# Altium project EE_smallOB_BW_v1.0.PrjPcb (part 4 of 4)

## Sheet interface2.SchDoc
size A
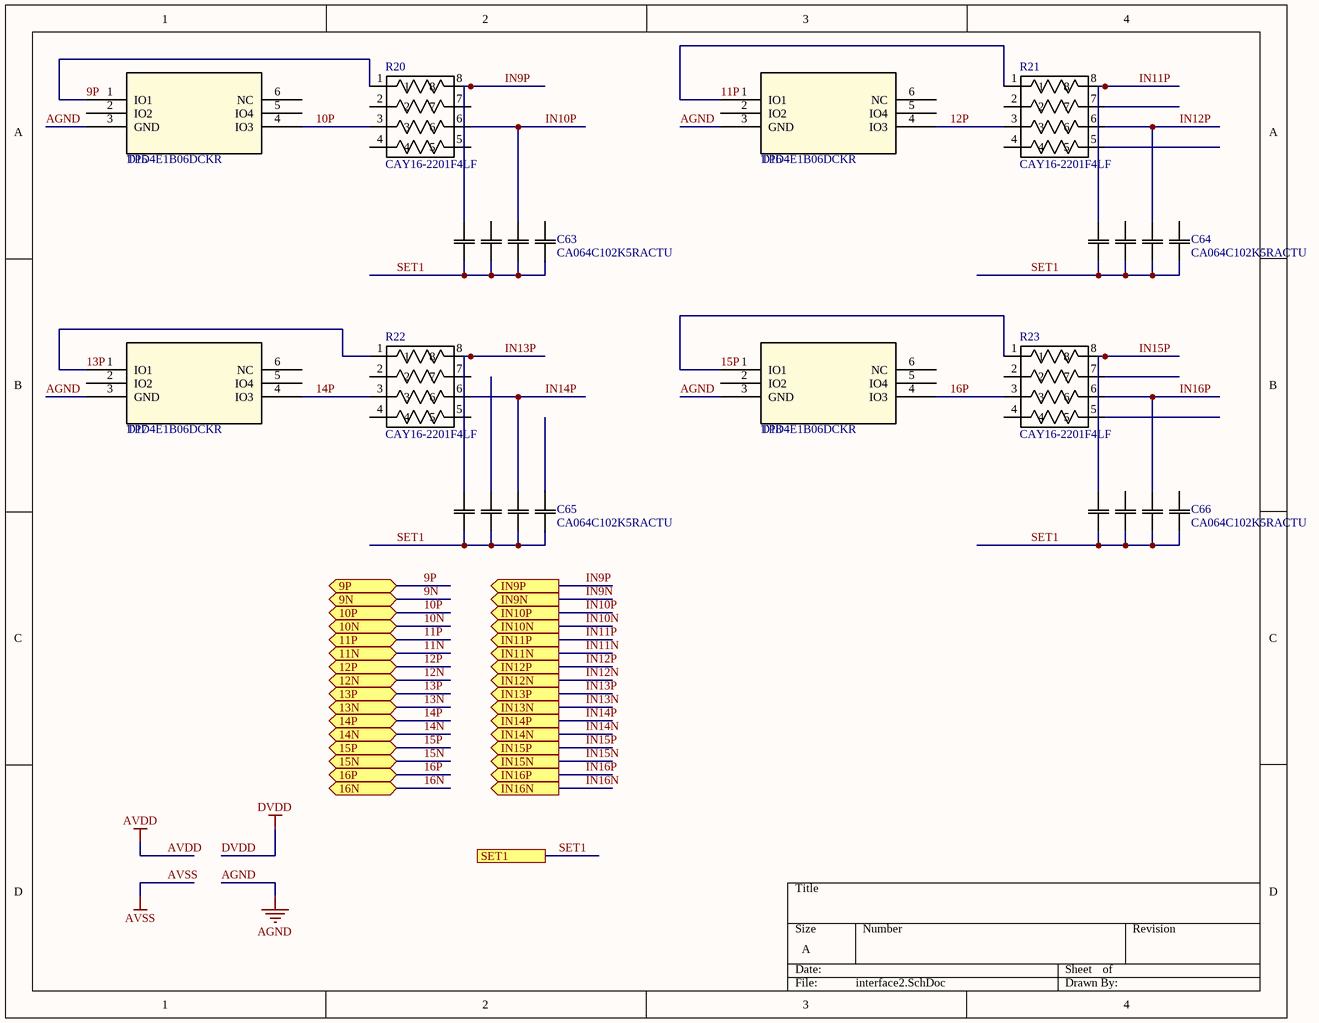
[diagram p5: interface2.SchDoc]

### Parts
C63  CA064C102K5RACTU  [CA064]
C64  CA064C102K5RACTU  [CA064]
C65  CA064C102K5RACTU  [CA064]
C66  CA064C102K5RACTU  [CA064]
D15  TPD4E1B06DCKR  [DCK6]
D16  TPD4E1B06DCKR  [DCK6]
D17  TPD4E1B06DCKR  [DCK6]
D18  TPD4E1B06DCKR  [DCK6]
R20  CAY16-2201F4LF  [*RESCAXE80P320X160-8N]
R21  CAY16-2201F4LF  [*RESCAXE80P320X160-8N]
R22  CAY16-2201F4LF  [*RESCAXE80P320X160-8N]
R23  CAY16-2201F4LF  [*RESCAXE80P320X160-8N]

### Ports
9N (bidir), 9P (bidir), 10N (bidir), 10P (bidir), 11N (bidir), 11P (bidir), 12N (bidir), 12P (bidir), 13N (bidir), 13P (bidir), 14N (bidir), 14P (bidir), 15N (bidir), 15P (bidir), 16N (bidir), 16P (bidir), IN9N (out), IN9P (out), IN10N (out), IN10P (out), IN11N (out), IN11P (out), IN12N (out), IN12P (out), IN13N (out), IN13P (out), IN14N (out), IN14P (out), IN15N (out), IN15P (out), IN16N (out), IN16P (out), SET1

### Nets
AGND: D15.3(GND) D16.3(GND) D17.3(GND) D18.3(GND)
9N: port 9N
9P: D15.1(IO1) R20.1 ; port 9P
10N: port 10N
10P: D15.4(IO3) R20.3 ; port 10P
11N: port 11N
11P: D16.1(IO1) R21.1 ; port 11P
12N: port 12N
12P: D16.4(IO3) R21.3 ; port 12P
13N: port 13N
13P: D17.1(IO1) R22.1 ; port 13P
14N: port 14N
14P: D17.4(IO3) R22.3 ; port 14P
15N: port 15N
15P: D18.1(IO1) R23.1 ; port 15P
16N: port 16N
16P: D18.4(IO3) R23.3 ; port 16P
IN9N: port IN9N
IN9P: C63.8 R20.8 ; port IN9P
IN10N: port IN10N
IN10P: C63.6 R20.6 ; port IN10P
IN11N: port IN11N
IN11P: C64.8 R21.8 ; port IN11P
IN12N: port IN12N
IN12P: C64.6 R21.6 ; port IN12P
IN13N: port IN13N
IN13P: C65.8 R22.8 ; port IN13P
IN14N: port IN14N
IN14P: C65.6 R22.6 ; port IN14P
IN15N: port IN15N
IN15P: C66.8 R23.8 ; port IN15P
IN16N: port IN16N
IN16P: C66.6 R23.6 ; port IN16P
SET1: C63.1 C63.2 C63.3 C63.4 C64.1 C64.2 C64.3 C64.4 C65.1 C65.2 C65.3 C65.4 C66.1 C66.2 C66.3 C66.4 ; port SET1

Not connected (* = marked no-connect by the designer): C63 5 7; C64 5 7; C65 5 7; C66 5 7; D15 2(IO2) 5(IO4) 6(NC); D16 2(IO2) 5(IO4) 6(NC); D17 2(IO2) 5(IO4) 6(NC); D18 2(IO2) 5(IO4) 6(NC); R20 2 4 5 7; R21 2 4 5 7; R22 2 4 5 7; R23 2 4 5 7

### Library data of the parts
C63-C66 = CA064C102K5RACTU: CAP ARRAY 1000PF 50V X7R 0612; Manufacturer 1: KEMET; Dielectric Material: Ceramic; Capacitance: 1nF; Tolerance: 10%; Number of Capacitors: 4; Circuit Type: Isolated; Supplier 1: Digi-Key; Manufacturer Part Number 1: CA064C102K5RACTU; Stock 1: 12; Pricing 1: 1=0.61000, 10=0.42800, 100=0.28180, 500=0.20874, 1000=0.17743 (USD); RoHS: Yes; Mount: Surface Mount; Case/Package: 0612; Case Code (Metric): 1632; Case Code (Imperial): 0612; Contact Plating: Tin,Matte; Number of Terminals: 8; Min Operating Temperature: -55°C; Max Operating Temperature: 125°C; Packaging: Tape and Reel; Package Quantity: 4000; Voltage Rating: 50V; Dielectric: X7R; Termination: SMD/SMT; Number of Elements: 4; Voltage Rating (DC): 50V; Number of Circuits: 4; Length: 0.063inch; Height: 0.8mm; Width: 1.6mm; Height - Seated (Max): 0.035inch; Terminal Pitch: 0.8mm; REACH SVHC: No SVHC; Lead Free: Lead Free; ComponentLink1URL: http://www.farnell.com/datasheets/1868478.pdf?src-supplier=Farnell; ComponentLink1Description: http://www.farnell.com/datasheets/1868478.pdf?src-supplier=Farnell; ComponentLink2URL: https://media.digikey.com/pdf/Data%20Sheets/Kemet%20PDFs/X7R_Dielectric_10-200V_Rev_Nov2013.pdf?src-supplier=Digi-Key; ComponentLink2Description: https://media.digikey.com/pdf/Data%20Sheets/Kemet%20PDFs/X7R_Dielectric_10-200V_Rev_Nov2013.pdf?src-supplier=Digi-Key; ComponentLink3URL: http://www.mouser.com/ds/2/212/KEM_C1017_X7R_ARRAY_SMD-1102778.pdf?src-supplier=Mouser; ComponentLink3Description: http://www.mouser.com/ds/2/212/KEM_C1017_X7R_ARRAY_SMD-1102778.pdf?src-supplier=Mouser; ComponentLink4URL: http://www.farnell.com/datasheets/1868478.pdf?src-supplier=Element14; ComponentLink4Description: http://www.farnell.com/datasheets/1868478.pdf?src-supplier=Element14; ComponentLink5URL: http://capacitoredge.kemet.com/capedge2/DataSheet/Datasheet-CA064C102K5RACTU.pdf?pn=CA064C102K5RACTU&src-supplier=Avnet; ComponentLink5Description: http://capacitoredge.kemet.com/capedge2/DataSheet/Datasheet-CA064C102K5RACTU.pdf?pn=CA064C102K5RACTU&src-supplier=Avnet; ComponentLink6URL: http://capacitoredge.kemet.com/capedge2/DataSheet/Datasheet-CA064C102K5RACTU.pdf?pn=CA064C102K5RACTU&src-supplier=Avnet+Asia; ComponentLink6Description: http://capacitoredge.kemet.com/capedge2/DataSheet/Datasheet-CA064C102K5RACTU.pdf?pn=CA064C102K5RACTU&src-supplier=Avnet+Asia; Supplier Part Number 1: 399-9415-1-ND
D15-D18 = TPD4E1B06DCKR: TVS DIODE 5.5VWM 14.5VC SC70-6; Manufacturer 1: Texas Instruments; Capacitance: 1pF; Operating Supply Voltage: 5.5V; Direction: Bidirectional,Unidirectional; Number of Bidirectional Channels: 4; Min Breakdown Voltage: 7V; Clamping Voltage: 14.5V; Peak Pulse Power: 45W; Power Line Protection: No; Polarity: Bidirectional; ESD Protection: Yes; Max Reverse Leakage Current: 500pA; Test Current: 1mA; Peak Pulse Current: 3A; Interface: LVDS,USB; Supplier 1: Digi-Key; Manufacturer Part Number 1: TPD4E1B06DCKR; Stock 1: 27694; Pricing 1: 1=0.58000, 10=0.49400, 100=0.36920, 500=0.29004, 1000=0.22413 (USD); RoHS: Yes; Mount: Surface Mount; Case/Package: SC; Number of Pins: 6; Min Operating Temperature: -40°C; Max Operating Temperature: 125°C; Package Quantity: 3000; Packaging: Tape and Reel; Reverse Standoff Voltage: 5.5V; Breakdown Voltage: 7V; Number of Channels: 4; Termination: SMD/SMT; Working Voltage: 5.5V; Max Power Dissipation: 45W; Length: 2.15mm; Height: 1mm; Width: 1.4mm; REACH SVHC: No SVHC; Lead Free: Lead Free; ComponentLink1URL: https://datasheet.ciiva.com/12545/tpd4e1b06-224687-12545147.pdf?src-supplier=Mouser; ComponentLink1Description: https://datasheet.ciiva.com/12545/tpd4e1b06-224687-12545147.pdf?src-supplier=Mouser; ComponentLink2URL: https://datasheet.ciiva.com/6574/tpd4e1b06-6574671.pdf?src-supplier=Digi-Key; ComponentLink2Description: https://datasheet.ciiva.com/6574/tpd4e1b06-6574671.pdf?src-supplier=Digi-Key; Supplier Part Number 1: 296-39346-1-ND
R20-R23 = CAY16-2201F4LF: BOURNS         CAY16-2201F4LF             RESISTOR, ARRAY-4, 2.2KOHM, 5%, SMD; Resistance: 2.2kR; Tolerance: 1%; Power Rating: 248mW; Voltage Rating: 50V; Number of Elements: 4; Circuit Type: Isolated; Power Per Element: 62.5mW; Temperature Coefficient: 200ppm/°C; Supplier 1: Digi-Key; Manufacturer 1: Bourns; Manufacturer Part Number 1: CAY16-2201F4LF; Stock 1: 35310; Pricing 1: 1=0.14000, 10=0.12100, 25=0.08800, 50=0.06380, 100=0.04730, 250=0.03632, 500=0.02860, 1000=0.01980 (USD); RoHS: Yes; Mount: Surface Mount; Case/Package: 1206; Number of Pins: 8; Case Code (Metric): 3216; Case Code (Imperial): 1206; Number of Terminals: 8; Contact Plating: Tin; Min Operating Temperature: -55°C; Max Operating Temperature: 125°C; Packaging: Tape and Reel; Package Quantity: 1; Number of Resistors: 4; Termination: Convex; Military Standard: Not; Voltage Rating (DC): 50V; Number of Circuits: 4; Length: 3.2mm; Height: 0.024inch; Width: 0.063inch; Lead Pitch: 0.8mm; Terminal Pitch: 0.8mm; Depth: 1.6mm; REACH SVHC: No SVHC; Lead Free: Lead Free; ComponentLink1URL: https://datasheet.ciiva.com/11807/0900766b8064e462-11807027.pdf?src-supplier=RSComponents; ComponentLink1Description: https://datasheet.ciiva.com/11807/0900766b8064e462-11807027.pdf?src-supplier=RSComponents; ComponentLink2URL: https://datasheet.ciiva.com/16967/catcay-16967355.pdf?src-supplier=Avnet+Europe; ComponentLink2Description: https://datasheet.ciiva.com/16967/catcay-16967355.pdf?src-supplier=Avnet+Europe; ComponentLink3URL: https://datasheet.ciiva.com/6533/catcay-6533677.pdf?src-supplier=Digi-Key; ComponentLink3Description: https://datasheet.ciiva.com/6533/catcay-6533677.pdf?src-supplier=Digi-Key; ComponentLink4URL: https://datasheet.ciiva.com/30021/catcay-30021357.pdf?src-supplier=Avnet; ComponentLink4Description: https://datasheet.ciiva.com/30021/catcay-30021357.pdf?src-supplier=Avnet; ComponentLink5URL: https://datasheet.ciiva.com/1478/1849489-1478846.pdf?src-supplier=Element14; ComponentLink5Description: https://datasheet.ciiva.com/1478/1849489-1478846.pdf?src-supplier=Element14; ComponentLink6URL: https://datasheet.ciiva.com/6533/catcay-6533678.pdf?src-supplier=Digi-Key; ComponentLink6Description: https://datasheet.ciiva.com/6533/catcay-6533678.pdf?src-supplier=Digi-Key; ComponentLink7URL: https://datasheet.ciiva.com/1478/1849489-1478847.pdf?src-supplier=Element14; ComponentLink7Description: https://datasheet.ciiva.com/1478/1849489-1478847.pdf?src-supplier=Element14; ComponentLink8URL: https://datasheet.ciiva.com/6533/catcay-6533679.pdf?src-supplier=Digi-Key; ComponentLink8Description: https://datasheet.ciiva.com/6533/catcay-6533679.pdf?src-supplier=Digi-Key; ComponentLink9URL: https://datasheet.ciiva.com/48692/001055385-da-01-en-wid-arr-cay16-2201f4lf-2-2k-ohm-4-w-1206-48692149.pdf?src-supplier=Conrad; ComponentLink9Description: https://datasheet.ciiva.com/48692/001055385-da-01-en-wid-arr-cay16-2201f4lf-2-2k-ohm-4-w-1206-48692149.pdf?src-supplier=Conrad; Supplier Part Number 1: CAY16-2201F4LFCT-ND

## Sheet ADS_1.SchDoc
size A
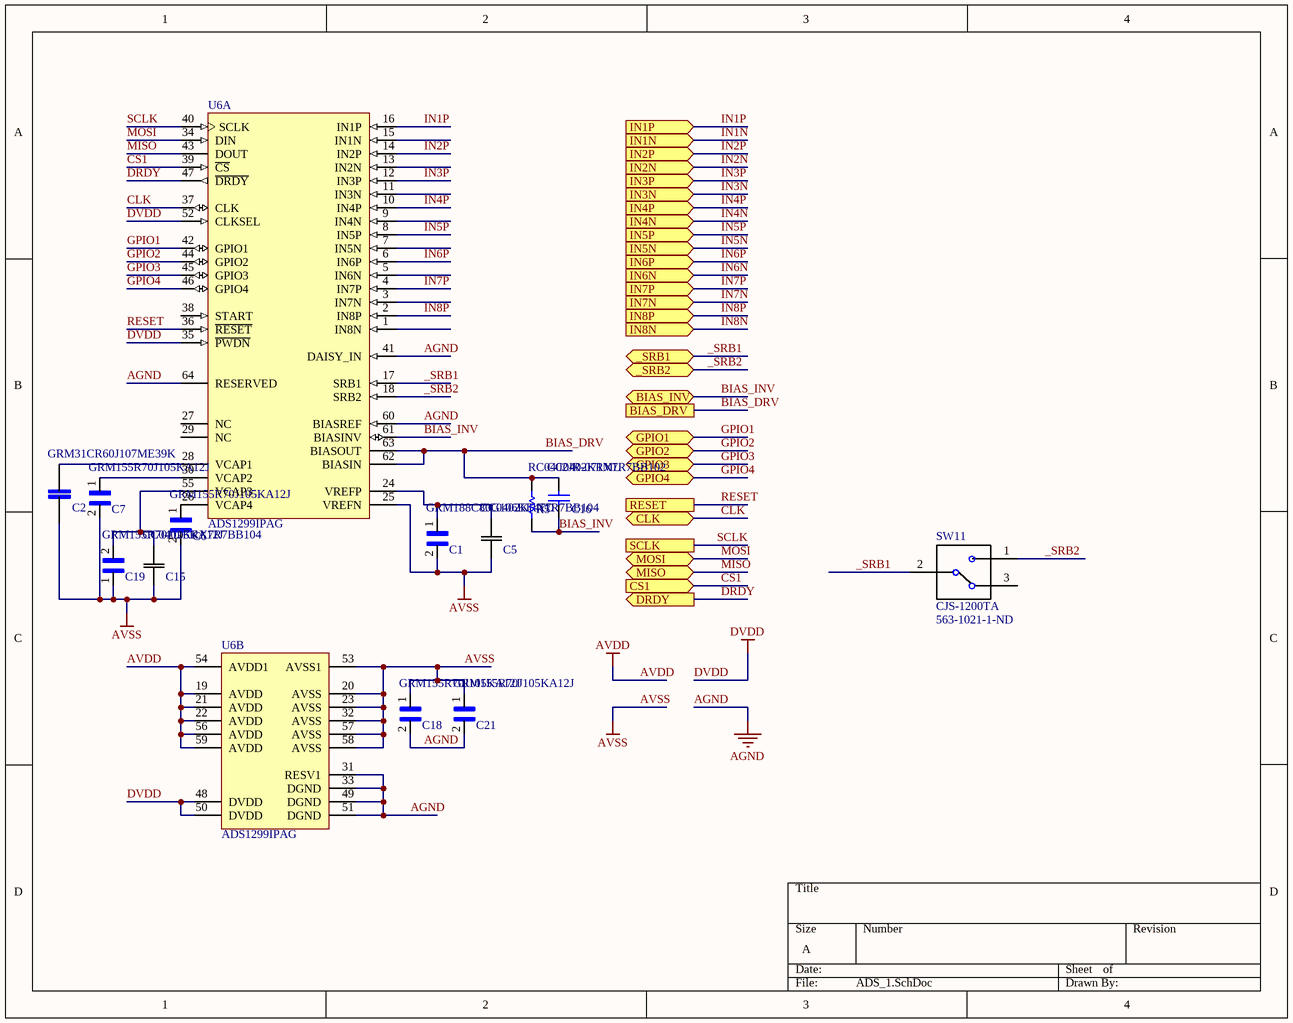
[diagram p6: ADS_1.SchDoc]

### Parts
C1  GRM188C80G106KE47D  [*CAPC1608X90N]
C2  GRM31CR60J107ME39K  [*CAPC3216X190]
C5  CC0402KRX7R7BB104  [YAG_CC0402]
C6  GRM155R70J105KA12J  [*CAPC1005X55N]
C7  GRM155R70J105KA12J  [*CAPC1005X55N]
C15  CC0402KRX7R7BB104  [YAG_CC0402]
C16  CC0402KRX7R7BB102  [CAPC1005X55X23NL05T08]
C18  GRM155R70J105KA12J  [*CAPC1005X55N]
C19  GRM155R70J105KA12J  [*CAPC1005X55N]
C21  GRM155R70J105KA12J  [*CAPC1005X55N]
R5  RC0402JR-071ML  [RESC1005X40X25NL05T10]
SW11  CJS-1200TA  Supplier Part Number 1: 563-1021-1-ND  [*SW_CJS-1200TA]
U6  ADS1299IPAG  [PAG0064A_N]  (parts A,B of 2)

### Ports
_SRB1 (bidir), _SRB2 (bidir), BIAS_DRV, BIAS_INV (bidir), CLK (bidir), CS1 (in), DRDY (out), GPIO1 (bidir), GPIO2 (bidir), GPIO3 (bidir), GPIO4 (bidir), IN1N (in), IN1P (in), IN2N (in), IN2P (in), IN3N (in), IN3P (in), IN4N (in), IN4P (in), IN5N (in), IN5P (in), IN6N (in), IN6P (in), IN7N (in), IN7P (in), IN8N (in), IN8P (in), MISO (bidir), MOSI (bidir), RESET, SCLK

### Nets
AGND: C18.2 C21.2 U6.31(RESV1) U6.33(DGND) U6.41(DAISY_IN) U6.49(DGND) U6.51(DGND) U6.60(BIASREF) U6.64(RESERVED)
AVDD: U6.19(AVDD) U6.21(AVDD) U6.22(AVDD) U6.54(AVDD1) U6.56(AVDD) U6.59(AVDD)
AVSS: C1.2 C2.2 C5.2 C6.2 C7.2 C15.1 C18.1 C19.1 C21.1 U6.20(AVSS) U6.23(AVSS) U6.25(VREFN) U6.32(AVSS) U6.53(AVSS1) U6.57(AVSS) U6.58(AVSS)
DVDD: U6.35(~{PWDN}) U6.48(DVDD) U6.50(DVDD) U6.52(CLKSEL)
_SRB1: SW11.2 U6.17(SRB1) ; port _SRB1
_SRB2: SW11.1 U6.18(SRB2) ; port _SRB2
BIAS_DRV: C16.1 R5.1 U6.62(BIASIN) U6.63(BIASOUT) ; port BIAS_DRV
BIAS_INV: C16.2 R5.2 U6.61(BIASINV) ; port BIAS_INV
CLK: U6.37(CLK) ; port CLK
CS1: U6.39(~{CS}) ; port CS1
DRDY: U6.47(~{DRDY}) ; port DRDY
GPIO1: U6.42(GPIO1) ; port GPIO1
GPIO2: U6.44(GPIO2) ; port GPIO2
GPIO3: U6.45(GPIO3) ; port GPIO3
GPIO4: U6.46(GPIO4) ; port GPIO4
IN1N: port IN1N
IN1P: U6.16(IN1P) ; port IN1P
IN2N: port IN2N
IN2P: U6.14(IN2P) ; port IN2P
IN3N: port IN3N
IN3P: U6.12(IN3P) ; port IN3P
IN4N: port IN4N
IN4P: U6.10(IN4P) ; port IN4P
IN5N: port IN5N
IN5P: U6.8(IN5P) ; port IN5P
IN6N: port IN6N
IN6P: U6.6(IN6P) ; port IN6P
IN7N: port IN7N
IN7P: U6.4(IN7P) ; port IN7P
IN8N: port IN8N
IN8P: U6.2(IN8P) ; port IN8P
MISO: U6.43(DOUT) ; port MISO
MOSI: U6.34(DIN) ; port MOSI
RESET: U6.36(~{RESET}) ; port RESET
SCLK: U6.40(SCLK) ; port SCLK
NetC1_1: C1.1 C5.1 U6.24(VREFP)
NetC2_1: C2.1 U6.28(VCAP1)
NetC6_1: C6.1 U6.26(VCAP4)
NetC7_1: C7.1 U6.30(VCAP2)
NetC15_2: C15.2 C19.2 U6.55(VCAP3)

Not connected (* = marked no-connect by the designer): SW11 3; U6 1(IN8N) 3(IN7N) 5(IN6N) 7(IN5N) 9(IN4N) 11(IN3N) 13(IN2N) 15(IN1N) 27(NC) 29(NC) 38(START)

### Library data of the parts
C1 = GRM188C80G106KE47D: CAP CER 10UF 4V X6S 0603; Manufacturer 1: Murata; Tolerance: 10%; Supplier 1: Digi-Key; Manufacturer Part Number 1: GRM188C80G106KE47D; Stock 1: 203819; Pricing 1: 1=0.17000, 10=0.11800, 100=0.05990, 500=0.04098, 1000=0.03625 (USD); RoHS: Yes; Mount: Surface Mount; Case/Package: 0603; Weight: 0.000222oz; Case Code (Metric): 1608; Case Code (Imperial): 0603; Min Operating Temperature: -55°C; Max Operating Temperature: 105°C; Capacitance: 10uF; Packaging: Tape and Reel; Voltage Rating: 4V; Dielectric: X6S; Termination: SMD/SMT; Voltage Rating (DC): 4V; Package Quantity: 4000; Length: 0.063inch; Height: 0.8mm; Width: 0.031inch; Thickness: 0.035inch; ComponentLink1URL: http://www.mouser.com/ds/2/281/c02e-2905.pdf?src-supplier=Mouser; ComponentLink1Description: http://www.mouser.com/ds/2/281/c02e-2905.pdf?src-supplier=Mouser; ComponentLink2URL: http://search.murata.co.jp/Ceramy/image/img/A01X/G101/ENG/GRM188C80G106KE47-01.pdf?src-supplier=Digi-Key; ComponentLink2Description: http://search.murata.co.jp/Ceramy/image/img/A01X/G101/ENG/GRM188C80G106KE47-01.pdf?src-supplier=Digi-Key; Supplier Part Number 1: 490-10469-1-ND
C2 = GRM31CR60J107ME39K: MURATA - GRM31CR60J107ME39K - COND, 100µF, 6.3V, 20%, X5R, 1206; Capacitance: 100uF; Supplier 1: Digi-Key; Manufacturer 1: Murata; Manufacturer Part Number 1: GRM31CR60J107ME39K; Stock 1: 407390; Pricing 1: 1=0.98000, 10=0.77400, 100=0.58060, 500=0.43870, 1000=0.38709, 2500=0.36128 (USD); RoHS: Yes; Mount: Surface Mount; Case/Package: 1206; Case Code (Imperial): 1206; Case Code (Metric): 3216; Min Operating Temperature: -55°C; Max Operating Temperature: 85°C; Tolerance: 20%; Packaging: Tape and Reel; Package Quantity: 1; Voltage Rating: 6.3V; Dielectric: X5R; Termination: SMD/SMT; Voltage: 6.3V; Voltage Rating (DC): 6.3V; Length: 3.2mm; Height: 1.6mm; Width: 0.063inch; Thickness: 0.071inch; Depth: 1.6mm; Radiation Hardening: No; REACH SVHC: No SVHC; Lead Free: Lead Free; ComponentLink1URL: https://datasheet.ciiva.com/13246/product-13246228.pdf?src-supplier=Mouser; ComponentLink1Description: https://datasheet.ciiva.com/13246/product-13246228.pdf?src-supplier=Mouser; ComponentLink2URL: https://datasheet.ciiva.com/18697/grm31cr60j107me39-01-18697367.pdf?src-supplier=Digi-Key; ComponentLink2Description: https://datasheet.ciiva.com/18697/grm31cr60j107me39-01-18697367.pdf?src-supplier=Digi-Key; ComponentLink3URL: https://datasheet.ciiva.com/18697/grm31cr60j107me39-01-18697368.pdf?src-supplier=Digi-Key; ComponentLink3Description: https://datasheet.ciiva.com/18697/grm31cr60j107me39-01-18697368.pdf?src-supplier=Digi-Key; ComponentLink4URL: https://datasheet.ciiva.com/18697/grm31cr60j107me39-01-18697369.pdf?src-supplier=Digi-Key; ComponentLink4Description: https://datasheet.ciiva.com/18697/grm31cr60j107me39-01-18697369.pdf?src-supplier=Digi-Key; Supplier Part Number 1: 490-7217-1-ND
C5 C15 = CC0402KRX7R7BB104: CAP CER 0.1UF 16V X7R 0402; Manufacturer 1: Yageo; Capacitance: 100nF; Tolerance: 10%; Supplier 1: Digi-Key; Manufacturer Part Number 1: CC0402KRX7R7BB104; Stock 1: 30032352; Pricing 1: 1=0.10000, 10=0.03200, 100=0.01420, 500=0.01014, 1000=0.00797, 2500=0.00724, 5000=0.00667 (USD); RoHS: Yes; Mount: Surface Mount; Case/Package: 0402; Number of Pins: 2; Case Code (Metric): 1005; Case Code (Imperial): 0402; Min Operating Temperature: -55°C; Max Operating Temperature: 125°C; Voltage Rating: 16V; Voltage Rating (DC): 16V; Packaging: Tape and Reel; Package Quantity: 1; Dielectric: X7R; Termination: SMD/SMT; Composition: Ceramic; Voltage: 16V; Length: 1mm; Height: 0.5mm; Width: 0.02inch; Thickness: 0.022inch; Depth: 0.5mm; Radiation Hardening: No; REACH SVHC: No SVHC; Lead Free: Lead Free; Halogen Free: Halogen Free; ComponentLink1URL: https://datasheet.ciiva.com/11788/0900766b80ce67ed-11788364.pdf?src-supplier=RSComponents; ComponentLink1Description: https://datasheet.ciiva.com/11788/0900766b80ce67ed-11788364.pdf?src-supplier=RSComponents; ComponentLink2URL: https://datasheet.ciiva.com/16625/upy-gphc-x7r-6-3v-to-50v-8-16625511.pdf?src-supplier=Avnet+Europe; ComponentLink2Description: https://datasheet.ciiva.com/16625/upy-gphc-x7r-6-3v-to-50v-8-16625511.pdf?src-supplier=Avnet+Europe; ComponentLink3URL: https://datasheet.ciiva.com/161/mlccorderingcode-161544.pdf?src-supplier=Digi-Key; ComponentLink3Description: https://datasheet.ciiva.com/161/mlccorderingcode-161544.pdf?src-supplier=Digi-Key; ComponentLink4URL: https://datasheet.ciiva.com/161/mlccorderingcode-161545.pdf?src-supplier=Digi-Key; ComponentLink4Description: https://datasheet.ciiva.com/161/mlccorderingcode-161545.pdf?src-supplier=Digi-Key; ComponentLink5URL: https://datasheet.ciiva.com/8033/1734573-8033661.pdf?src-supplier=Element14; ComponentLink5Description: https://datasheet.ciiva.com/8033/1734573-8033661.pdf?src-supplier=Element14; ComponentLink6URL: https://datasheet.ciiva.com/7978/1489800-7978111.pdf?src-supplier=Element14; ComponentLink6Description: https://datasheet.ciiva.com/7978/1489800-7978111.pdf?src-supplier=Element14; ComponentLink7URL: https://datasheet.ciiva.com/8033/1734573-8033663.pdf?src-supplier=Element14; ComponentLink7Description: https://datasheet.ciiva.com/8033/1734573-8033663.pdf?src-supplier=Element14; ComponentLink8URL: https://datasheet.ciiva.com/11587/upy-gphc-x7r-6-3v-to-50v-8-11587305.pdf?src-supplier=Avnet; ComponentLink8Description: https://datasheet.ciiva.com/11587/upy-gphc-x7r-6-3v-to-50v-8-11587305.pdf?src-supplier=Avnet; ComponentLink9URL: https://datasheet.ciiva.com/161/mlccorderingcode-161546.pdf?src-supplier=Digi-Key; ComponentLink9Description: https://datasheet.ciiva.com/161/mlccorderingcode-161546.pdf?src-supplier=Digi-Key; ComponentLink10URL: https://datasheet.ciiva.com/13395/upy-gphc-x7r-6-3v-to-50v-8-13395676.pdf?src-supplier=Mouser; ComponentLink10Description: https://datasheet.ciiva.com/13395/upy-gphc-x7r-6-3v-to-50v-8-13395676.pdf?src-supplier=Mouser; ComponentLink11URL: https://datasheet.ciiva.com/28450/1489800-28450335.pdf?src-supplier=Element14; ComponentLink11Description: https://datasheet.ciiva.com/28450/1489800-28450335.pdf?src-supplier=Element14; Supplier Part Number 1: 311-1338-1-ND
C6 C7 C18 C19 C21 = GRM155R70J105KA12J: CAP CER 1UF 6.3V X7R 0402; Manufacturer 1: Murata; Tolerance: 10%; Supplier 1: Digi-Key; Manufacturer Part Number 1: GRM155R70J105KA12J; Stock 1: 3268614; Pricing 1: 1=0.11000, 10=0.07900, 100=0.03700, 500=0.02596, 1000=0.02149, 2500=0.02000, 5000=0.01830 (USD); RoHS: Yes; Mount: Surface Mount; Case/Package: 0402; Weight: 0.000212oz; Case Code (Metric): 1005; Case Code (Imperial): 0402; Min Operating Temperature: -55°C; Max Operating Temperature: 125°C; Packaging: Tape and Reel; Capacitance: 1uF; Voltage Rating: 6.3V; Dielectric: X7R; Termination: SMD/SMT; Voltage Rating (DC): 6.3V; Package Quantity: 50000; Length: 0.039inch; Width: 0.02inch; Thickness: 0.022inch; ComponentLink1URL: http://www.mouser.com/ds/2/281/c02e-2905.pdf?src-supplier=Mouser; ComponentLink1Description: http://www.mouser.com/ds/2/281/c02e-2905.pdf?src-supplier=Mouser; ComponentLink2URL: http://search.murata.co.jp/Ceramy/image/img/A01X/G101/ENG/GRM155R70J105KA12-01.pdf?src-supplier=Digi-Key; ComponentLink2Description: http://search.murata.co.jp/Ceramy/image/img/A01X/G101/ENG/GRM155R70J105KA12-01.pdf?src-supplier=Digi-Key; Supplier Part Number 1: 490-13339-1-ND
C16 = CC0402KRX7R7BB102: CAP CER 1000PF 16V X7R 0402; Manufacturer 1: Yageo; Capacitance: 1nF; Tolerance: 10%; Supplier 1: Digi-Key; Manufacturer Part Number 1: CC0402KRX7R7BB102; Stock 1: 319318; Pricing 1: 1=0.10000, 10=0.02000, 100=0.00910, 500=0.00646, 1000=0.00508, 2500=0.00462, 5000=0.00425 (USD); RoHS: Yes; Mount: Surface Mount; Case/Package: 0402; Case Code (Imperial): 0402; Case Code (Metric): 1005; Min Operating Temperature: -55°C; Max Operating Temperature: 125°C; Packaging: Tape and Reel; Voltage Rating: 16V; Voltage Rating (DC): 16V; Package Quantity: 1; Dielectric: X7R; Termination: SMD/SMT; Composition: Ceramic; Length: 1mm; Height: 0.5mm; Width: 0.5mm; Thickness: 0.022inch; Depth: 0.5mm; Radiation Hardening: No; REACH SVHC: No SVHC; Lead Free: Lead Free; Halogen Free: Halogen Free; ComponentLink1URL: https://datasheet.ciiva.com/143/mlccorderingcode-143963.pdf?src-supplier=Digi-Key; ComponentLink1Description: https://datasheet.ciiva.com/143/mlccorderingcode-143963.pdf?src-supplier=Digi-Key; ComponentLink2URL: https://datasheet.ciiva.com/26862/getdatasheetpartid-698313-26862635.pdf?src-supplier=Verical; ComponentLink2Description: https://datasheet.ciiva.com/26862/getdatasheetpartid-698313-26862635.pdf?src-supplier=Verical; ComponentLink3URL: https://datasheet.ciiva.com/143/mlccorderingcode-143964.pdf?src-supplier=Digi-Key; ComponentLink3Description: https://datasheet.ciiva.com/143/mlccorderingcode-143964.pdf?src-supplier=Digi-Key; ComponentLink4URL: https://datasheet.ciiva.com/17437/upy-gphc-x7r-6-3v-to-50v-8-17437337.pdf?src-supplier=Avnet+Europe; ComponentLink4Description: https://datasheet.ciiva.com/17437/upy-gphc-x7r-6-3v-to-50v-8-17437337.pdf?src-supplier=Avnet+Europe; ComponentLink5URL: https://datasheet.ciiva.com/143/mlccorderingcode-143962.pdf?src-supplier=Digi-Key; ComponentLink5Description: https://datasheet.ciiva.com/143/mlccorderingcode-143962.pdf?src-supplier=Digi-Key; ComponentLink6URL: https://datasheet.ciiva.com/7978/1489800-7978107.pdf?src-supplier=Element14; ComponentLink6Description: https://datasheet.ciiva.com/7978/1489800-7978107.pdf?src-supplier=Element14; ComponentLink7URL: https://datasheet.ciiva.com/11464/upy-gphc-x7r-6-3v-to-50v-8-11464876.pdf?src-supplier=Avnet; ComponentLink7Description: https://datasheet.ciiva.com/11464/upy-gphc-x7r-6-3v-to-50v-8-11464876.pdf?src-supplier=Avnet; Supplier Part Number 1: 311-1352-1-ND
R5 = RC0402JR-071ML: RES SMD 1M OHM 5% 1/16W 0402; Manufacturer 1: Yageo; Resistance: 1MR; Power Rating: 62.5mW; Voltage Rating: 50V; Temperature Coefficient: 100ppm/°C; Max Power Dissipation: 63mW; Supplier 1: Digi-Key; Manufacturer Part Number 1: RC0402JR-071ML; Stock 1: 2568291; Pricing 1: 1=0.10000, 10=0.01300, 100=0.00550, 1000=0.00245, 2500=0.00212, 5000=0.00176 (USD); RoHS: Yes; Case/Package: 0402; Weight: 2.3E-05oz; Case Code (Metric): 1005; Case Code (Imperial): 0402; Min Operating Temperature: -55°C; Max Operating Temperature: 155°C; Package Quantity: 1; Tolerance: 5%; Packaging: Tape and Reel; Composition: Thick Film; Number of Terminations: 2; Termination: SMD/SMT; Military Standard: Not; Features: Moisture Resistant; Length: 1mm; Height: 0.016inch; Width: 0.02inch; Depth: 0.5mm; REACH SVHC: No SVHC; Lead Free: Lead Free; ComponentLink1URL: https://datasheet.ciiva.com/2452/pyu-r-int-thick-7-2452736.pdf?src-supplier=Digi-Key; ComponentLink1Description: https://datasheet.ciiva.com/2452/pyu-r-int-thick-7-2452736.pdf?src-supplier=Digi-Key; ComponentLink2URL: https://datasheet.ciiva.com/7983/1018594-7983560.pdf?src-supplier=Element14; ComponentLink2Description: https://datasheet.ciiva.com/7983/1018594-7983560.pdf?src-supplier=Element14; ComponentLink3URL: https://datasheet.ciiva.com/12577/pyu-rc0402-51-rohs-l-6-r-12577354.pdf?src-supplier=Mouser; ComponentLink3Description: https://datasheet.ciiva.com/12577/pyu-rc0402-51-rohs-l-6-r-12577354.pdf?src-supplier=Mouser; ComponentLink4URL: https://datasheet.ciiva.com/17085/pyu-rc0402-51-rohs-l-6-r-17085739.pdf?src-supplier=Future+Electronics; ComponentLink4Description: https://datasheet.ciiva.com/17085/pyu-rc0402-51-rohs-l-6-r-17085739.pdf?src-supplier=Future+Electronics; ComponentLink5URL: https://datasheet.ciiva.com/7850/1018594-7850172.pdf?src-supplier=Element14; ComponentLink5Description: https://datasheet.ciiva.com/7850/1018594-7850172.pdf?src-supplier=Element14; ComponentLink6URL: https://datasheet.ciiva.com/7850/1018594-7850173.pdf?src-supplier=Element14; ComponentLink6Description: https://datasheet.ciiva.com/7850/1018594-7850173.pdf?src-supplier=Element14; ComponentLink7URL: https://datasheet.ciiva.com/2452/pyu-r-int-thick-7-2452734.pdf?src-supplier=Digi-Key; ComponentLink7Description: https://datasheet.ciiva.com/2452/pyu-r-int-thick-7-2452734.pdf?src-supplier=Digi-Key; ComponentLink8URL: https://datasheet.ciiva.com/2452/pyu-r-int-thick-7-2452735.pdf?src-supplier=Digi-Key; ComponentLink8Description: https://datasheet.ciiva.com/2452/pyu-r-int-thick-7-2452735.pdf?src-supplier=Digi-Key; Supplier Part Number 1: 311-1.0MJRCT-ND
SW11 = CJS-1200TA: SWITCH SLIDE SPDT 100MA 6V; Manufacturer 1: Nidec Copal; Body Material: Polyphenylene; Number of Positions: 2; Electrical Life: 200Cycles; Max Voltage Rating (DC): 24V; Actuator Type: Slide (Standard); Washable: Yes; Supplier 1: Digi-Key; Manufacturer Part Number 1: CJS-1200TA; Stock 1: 72766; Pricing 1: 1=0.88000, 10=0.86000, 25=0.81000, 50=0.76040, 100=0.72730, 250=0.69428, 500=0.62814 (USD); RoHS: Yes; Mount: Surface Mount; Contact Material: Copper Alloy; Contact Plating: Gold; Min Operating Temperature: -40°C; Max Operating Temperature: 85°C; Packaging: Tape and Reel; Throw Configuration: SPDT; Voltage Rating (DC): 6V; Current Rating: 100mA; Termination: J-Hook; Orientation: Vertical; Length: 0.212inch; Radiation Hardening: No; Lead Free: Lead Free; ComponentLink1URL: https://datasheet.ciiva.com/2864/cjs-2864476.pdf?src-supplier=Digi-Key; ComponentLink1Description: https://datasheet.ciiva.com/2864/cjs-2864476.pdf?src-supplier=Digi-Key; ComponentLink2URL: https://datasheet.ciiva.com/2864/cjs-2864477.pdf?src-supplier=Digi-Key; ComponentLink2Description: https://datasheet.ciiva.com/2864/cjs-2864477.pdf?src-supplier=Digi-Key; ComponentLink3URL: https://datasheet.ciiva.com/2864/cjs-2864478.pdf?src-supplier=Digi-Key; ComponentLink3Description: https://datasheet.ciiva.com/2864/cjs-2864478.pdf?src-supplier=Digi-Key
U6 = ADS1299IPAG: IC AFE 24BIT 16KSPS LN 64TQFP; Manufacturer 1: Texas Instruments; Number of Channels: 8; Max Power Dissipation: 42mW; Max Supply Voltage: 5.25V; Interface: SPI; Resolution: 24b; Number of Bits: 24; Sampling Rate: 16KS/s; Operating Supply Current: 7.14mA; Signal to Noise Ratio (SNR): 121dB; Power Consumption: 41mW; Min Supply Voltage: 4.75V; Supplier 1: Digi-Key; Manufacturer Part Number 1: ADS1299IPAG; Stock 1: 447; Pricing 1: 1=55.18000, 10=51.83200, 25=50.16000, 100=46.48160 (USD); RoHS: Yes; Case/Package: TQFP; Number of Pins: 64; Contact Plating: Gold; Min Operating Temperature: -40°C; Max Operating Temperature: 85°C; Package Quantity: 160; Packaging: Rail/Tube; Number of Converters: 8; Conversion Rate: 16KS/s; Number of Inputs: 8; Number of A/D Converters: 8; Type: General Purpose; Radiation Hardening: No; Lead Free: Lead Free; REACH SVHC: No SVHC; ComponentLink1URL: https://datasheet.ciiva.com/13063/ads1299-224171-13063283.pdf?src-supplier=Mouser; ComponentLink1Description: https://datasheet.ciiva.com/13063/ads1299-224171-13063283.pdf?src-supplier=Mouser; ComponentLink2URL: https://datasheet.ciiva.com/26913/getdatasheetpartid-563195-26913237.pdf?src-supplier=Verical; ComponentLink2Description: https://datasheet.ciiva.com/26913/getdatasheetpartid-563195-26913237.pdf?src-supplier=Verical; ComponentLink3URL: https://datasheet.ciiva.com/6668/ads1299-6668469.pdf?src-supplier=Digi-Key; ComponentLink3Description: https://datasheet.ciiva.com/6668/ads1299-6668469.pdf?src-supplier=Digi-Key; Supplier Part Number 1: 296-35009-ND

## Sheet interface1.SchDoc
size A
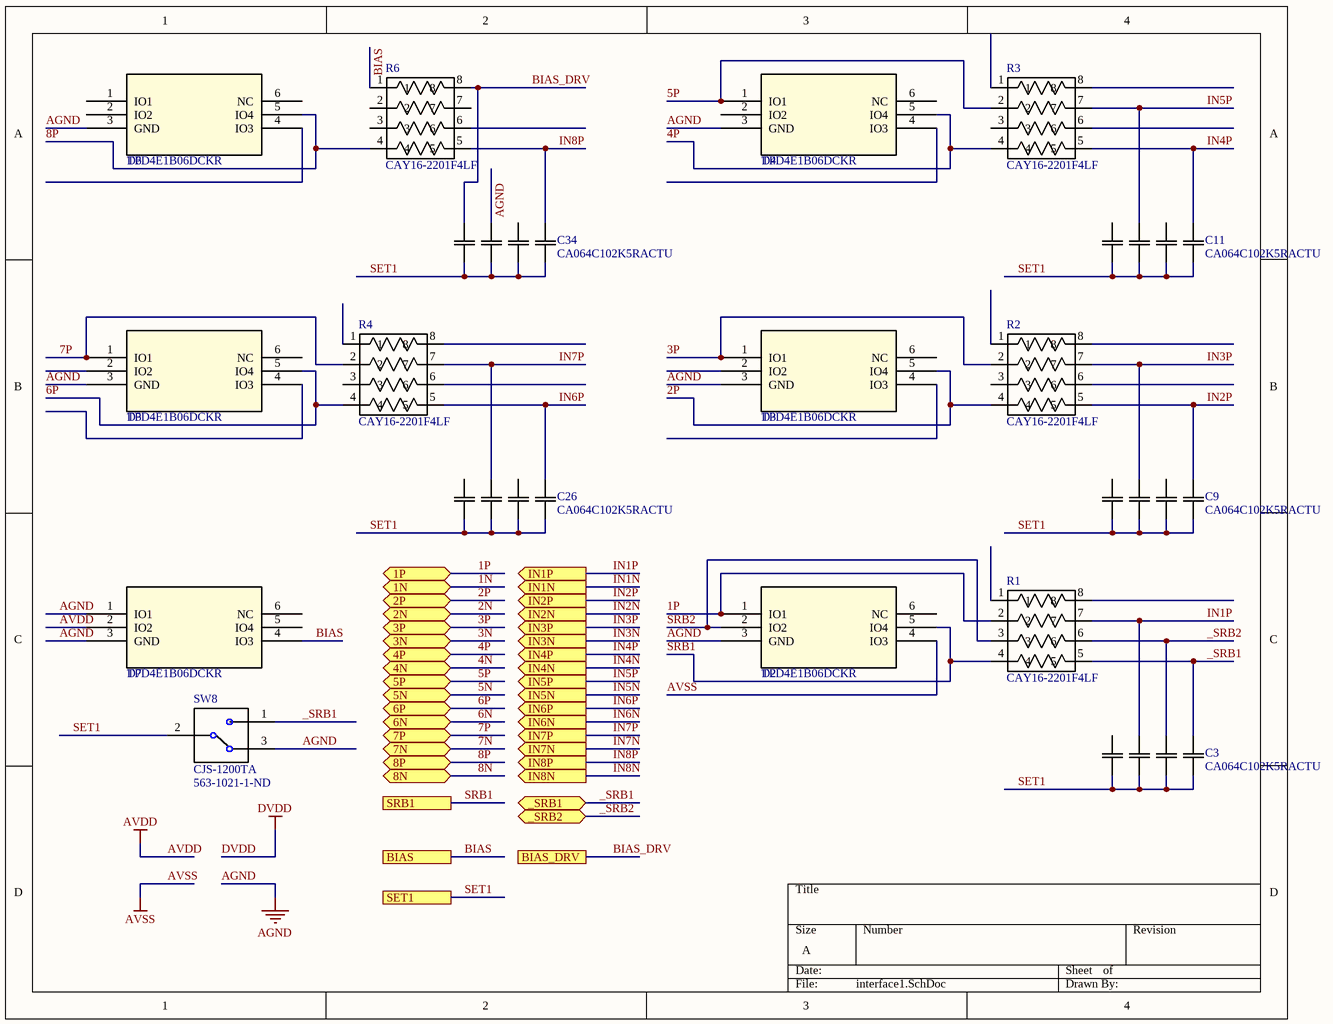
[diagram p7: interface1.SchDoc]

### Parts
C3  CA064C102K5RACTU  [CA064]
C9  CA064C102K5RACTU  [CA064]
C11  CA064C102K5RACTU  [CA064]
C26  CA064C102K5RACTU  [CA064]
C34  CA064C102K5RACTU  [CA064]
D2  TPD4E1B06DCKR  [DCK6]
D3  TPD4E1B06DCKR  [DCK6]
D4  TPD4E1B06DCKR  [DCK6]
D5  TPD4E1B06DCKR  [DCK6]
D6  TPD4E1B06DCKR  [DCK6]
D7  TPD4E1B06DCKR  [DCK6]
R1  CAY16-2201F4LF  [*RESCAXE80P320X160-8N]
R2  CAY16-2201F4LF  [*RESCAXE80P320X160-8N]
R3  CAY16-2201F4LF  [*RESCAXE80P320X160-8N]
R4  CAY16-2201F4LF  [*RESCAXE80P320X160-8N]
R6  CAY16-2201F4LF  [*RESCAXE80P320X160-8N]
SW8  CJS-1200TA  Supplier Part Number 1: 563-1021-1-ND  [*SW_CJS-1200TA]

### Ports
1N (bidir), 1P (bidir), 2N (bidir), 2P (bidir), 3N (bidir), 3P (bidir), 4N (bidir), 4P (bidir), 5N (bidir), 5P (bidir), 6N (bidir), 6P (bidir), 7N (bidir), 7P (bidir), 8N (bidir), 8P (bidir), _SRB1 (bidir), _SRB2 (bidir), BIAS, BIAS_DRV, IN1N (out), IN1P (out), IN2N (out), IN2P (out), IN3N (out), IN3P (out), IN4N (out), IN4P (out), IN5N (out), IN5P (out), IN6N (out), IN6P (out), IN7N (out), IN7P (out), IN8N (out), IN8P (out), SET1, SRB1

### Nets
AGND: C34.7 D2.3(GND) D3.3(GND) D4.3(GND) D5.3(GND) D6.3(GND) D7.1(IO1) D7.3(GND) SW8.3
AVDD: D7.2(IO2)
AVSS: D2.4(IO3)
1N: port 1N
1P: D2.1(IO1) R1.2 ; port 1P
2N: port 2N
2P: D3.5(IO4) R2.4 ; port 2P
3N: port 3N
3P: D3.1(IO1) R2.2 ; port 3P
4N: port 4N
4P: D4.5(IO4) R3.4 ; port 4P
5N: port 5N
5P: D4.1(IO1) R3.2 ; port 5P
6N: port 6N
6P: D5.5(IO4) R4.4 ; port 6P
7N: port 7N
7P: D5.1(IO1) R4.2 ; port 7P
8N: port 8N
8P: D6.5(IO4) R6.4 ; port 8P
_SRB1: C3.5 R1.5 SW8.1 ; port _SRB1
_SRB2: C3.6 R1.6 ; port _SRB2
BIAS: D7.4(IO3) R6.1 ; port BIAS
BIAS_DRV: C34.8 R6.8 ; port BIAS_DRV
IN1N: port IN1N
IN1P: C3.7 R1.7 ; port IN1P
IN2N: port IN2N
IN2P: C9.5 R2.5 ; port IN2P
IN3N: port IN3N
IN3P: C9.7 R2.7 ; port IN3P
IN4N: port IN4N
IN4P: C11.5 R3.5 ; port IN4P
IN5N: port IN5N
IN5P: C11.7 R3.7 ; port IN5P
IN6N: port IN6N
IN6P: C26.5 R4.5 ; port IN6P
IN7N: port IN7N
IN7P: C26.7 R4.7 ; port IN7P
IN8N: port IN8N
IN8P: C34.5 R6.5 ; port IN8P
SET1: C3.1 C3.2 C3.3 C3.4 C9.1 C9.2 C9.3 C9.4 C11.1 C11.2 C11.3 C11.4 C26.1 C26.2 C26.3 C26.4 C34.1 C34.2 C34.3 C34.4 SW8.2 ; port SET1
SRB1: D2.5(IO4) R1.4 ; port SRB1
SRB2: D2.2(IO2) R1.3

Not connected (* = marked no-connect by the designer): C3 8; C9 6 8; C11 6 8; C26 6 8; C34 6; D2 6(NC); D3 2(IO2) 4(IO3) 6(NC); D4 2(IO2) 4(IO3) 6(NC); D5 2(IO2) 4(IO3) 6(NC); D6 1(IO1) 2(IO2) 4(IO3) 6(NC); D7 5(IO4) 6(NC); R1 1 8; R2 1 3 6 8; R3 1 3 6 8; R4 1 3 6 8; R6 2 3 6 7

### Library data of the parts
C3 C9 C11 C26 C34 = CA064C102K5RACTU: as C63 on sheet interface2; Supplier 1: Digi-Key; Manufacturer Part Number 1: CA064C102K5RACTU; Stock 1: 12; Pricing 1: 1=0.61000, 10=0.42800, 100=0.28180, 500=0.20874, 1000=0.17743 (USD); RoHS: Yes; Mount: Surface Mount; Case/Package: 0612; Case Code (Metric): 1632; Case Code (Imperial): 0612; Contact Plating: Tin,Matte; Number of Terminals: 8; Min Operating Temperature: -55°C; Max Operating Temperature: 125°C; Packaging: Tape and Reel; Package Quantity: 4000; Voltage Rating: 50V; Dielectric: X7R; Termination: SMD/SMT; Number of Elements: 4; Voltage Rating (DC): 50V; Number of Circuits: 4; Length: 0.063inch; Height: 0.8mm; Width: 1.6mm; Height - Seated (Max): 0.035inch; Terminal Pitch: 0.8mm; REACH SVHC: No SVHC; Lead Free: Lead Free; ComponentLink1URL: http://www.farnell.com/datasheets/1868478.pdf?src-supplier=Farnell; ComponentLink1Description: http://www.farnell.com/datasheets/1868478.pdf?src-supplier=Farnell; ComponentLink2URL: https://media.digikey.com/pdf/Data%20Sheets/Kemet%20PDFs/X7R_Dielectric_10-200V_Rev_Nov2013.pdf?src-supplier=Digi-Key; ComponentLink2Description: https://media.digikey.com/pdf/Data%20Sheets/Kemet%20PDFs/X7R_Dielectric_10-200V_Rev_Nov2013.pdf?src-supplier=Digi-Key; ComponentLink3URL: http://www.mouser.com/ds/2/212/KEM_C1017_X7R_ARRAY_SMD-1102778.pdf?src-supplier=Mouser; ComponentLink3Description: http://www.mouser.com/ds/2/212/KEM_C1017_X7R_ARRAY_SMD-1102778.pdf?src-supplier=Mouser; ComponentLink4URL: http://www.farnell.com/datasheets/1868478.pdf?src-supplier=Element14; ComponentLink4Description: http://www.farnell.com/datasheets/1868478.pdf?src-supplier=Element14; ComponentLink5URL: http://capacitoredge.kemet.com/capedge2/DataSheet/Datasheet-CA064C102K5RACTU.pdf?pn=CA064C102K5RACTU&src-supplier=Avnet; ComponentLink5Description: http://capacitoredge.kemet.com/capedge2/DataSheet/Datasheet-CA064C102K5RACTU.pdf?pn=CA064C102K5RACTU&src-supplier=Avnet; ComponentLink6URL: http://capacitoredge.kemet.com/capedge2/DataSheet/Datasheet-CA064C102K5RACTU.pdf?pn=CA064C102K5RACTU&src-supplier=Avnet+Asia; ComponentLink6Description: http://capacitoredge.kemet.com/capedge2/DataSheet/Datasheet-CA064C102K5RACTU.pdf?pn=CA064C102K5RACTU&src-supplier=Avnet+Asia; Supplier Part Number 1: 399-9415-1-ND
D2-D7 = TPD4E1B06DCKR: as D15 on sheet interface2; Supplier 1: Digi-Key; Manufacturer Part Number 1: TPD4E1B06DCKR; Stock 1: 27694; Pricing 1: 1=0.58000, 10=0.49400, 100=0.36920, 500=0.29004, 1000=0.22413 (USD); RoHS: Yes; Mount: Surface Mount; Case/Package: SC; Number of Pins: 6; Min Operating Temperature: -40°C; Max Operating Temperature: 125°C; Package Quantity: 3000; Packaging: Tape and Reel; Reverse Standoff Voltage: 5.5V; Breakdown Voltage: 7V; Number of Channels: 4; Termination: SMD/SMT; Working Voltage: 5.5V; Max Power Dissipation: 45W; Length: 2.15mm; Height: 1mm; Width: 1.4mm; REACH SVHC: No SVHC; Lead Free: Lead Free; ComponentLink1URL: https://datasheet.ciiva.com/12545/tpd4e1b06-224687-12545147.pdf?src-supplier=Mouser; ComponentLink1Description: https://datasheet.ciiva.com/12545/tpd4e1b06-224687-12545147.pdf?src-supplier=Mouser; ComponentLink2URL: https://datasheet.ciiva.com/6574/tpd4e1b06-6574671.pdf?src-supplier=Digi-Key; ComponentLink2Description: https://datasheet.ciiva.com/6574/tpd4e1b06-6574671.pdf?src-supplier=Digi-Key; Supplier Part Number 1: 296-39346-1-ND
R1-R4 R6 = CAY16-2201F4LF: as R20 on sheet interface2; Supplier 1: Digi-Key; Manufacturer 1: Bourns; Manufacturer Part Number 1: CAY16-2201F4LF; Stock 1: 35310; Pricing 1: 1=0.14000, 10=0.12100, 25=0.08800, 50=0.06380, 100=0.04730, 250=0.03632, 500=0.02860, 1000=0.01980 (USD); RoHS: Yes; Mount: Surface Mount; Case/Package: 1206; Number of Pins: 8; Case Code (Metric): 3216; Case Code (Imperial): 1206; Number of Terminals: 8; Contact Plating: Tin; Min Operating Temperature: -55°C; Max Operating Temperature: 125°C; Packaging: Tape and Reel; Package Quantity: 1; Number of Resistors: 4; Termination: Convex; Military Standard: Not; Voltage Rating (DC): 50V; Number of Circuits: 4; Length: 3.2mm; Height: 0.024inch; Width: 0.063inch; Lead Pitch: 0.8mm; Terminal Pitch: 0.8mm; Depth: 1.6mm; REACH SVHC: No SVHC; Lead Free: Lead Free; ComponentLink1URL: https://datasheet.ciiva.com/11807/0900766b8064e462-11807027.pdf?src-supplier=RSComponents; ComponentLink1Description: https://datasheet.ciiva.com/11807/0900766b8064e462-11807027.pdf?src-supplier=RSComponents; ComponentLink2URL: https://datasheet.ciiva.com/16967/catcay-16967355.pdf?src-supplier=Avnet+Europe; ComponentLink2Description: https://datasheet.ciiva.com/16967/catcay-16967355.pdf?src-supplier=Avnet+Europe; ComponentLink3URL: https://datasheet.ciiva.com/6533/catcay-6533677.pdf?src-supplier=Digi-Key; ComponentLink3Description: https://datasheet.ciiva.com/6533/catcay-6533677.pdf?src-supplier=Digi-Key; ComponentLink4URL: https://datasheet.ciiva.com/30021/catcay-30021357.pdf?src-supplier=Avnet; ComponentLink4Description: https://datasheet.ciiva.com/30021/catcay-30021357.pdf?src-supplier=Avnet; ComponentLink5URL: https://datasheet.ciiva.com/1478/1849489-1478846.pdf?src-supplier=Element14; ComponentLink5Description: https://datasheet.ciiva.com/1478/1849489-1478846.pdf?src-supplier=Element14; ComponentLink6URL: https://datasheet.ciiva.com/6533/catcay-6533678.pdf?src-supplier=Digi-Key; ComponentLink6Description: https://datasheet.ciiva.com/6533/catcay-6533678.pdf?src-supplier=Digi-Key; ComponentLink7URL: https://datasheet.ciiva.com/1478/1849489-1478847.pdf?src-supplier=Element14; ComponentLink7Description: https://datasheet.ciiva.com/1478/1849489-1478847.pdf?src-supplier=Element14; ComponentLink8URL: https://datasheet.ciiva.com/6533/catcay-6533679.pdf?src-supplier=Digi-Key; ComponentLink8Description: https://datasheet.ciiva.com/6533/catcay-6533679.pdf?src-supplier=Digi-Key; ComponentLink9URL: https://datasheet.ciiva.com/48692/001055385-da-01-en-wid-arr-cay16-2201f4lf-2-2k-ohm-4-w-1206-48692149.pdf?src-supplier=Conrad; ComponentLink9Description: https://datasheet.ciiva.com/48692/001055385-da-01-en-wid-arr-cay16-2201f4lf-2-2k-ohm-4-w-1206-48692149.pdf?src-supplier=Conrad; Supplier Part Number 1: CAY16-2201F4LFCT-ND
SW8 = CJS-1200TA: as SW11 on sheet ADS_1; Supplier 1: Digi-Key; Manufacturer Part Number 1: CJS-1200TA; Stock 1: 72766; Pricing 1: 1=0.88000, 10=0.86000, 25=0.81000, 50=0.76040, 100=0.72730, 250=0.69428, 500=0.62814 (USD); RoHS: Yes; Mount: Surface Mount; Contact Material: Copper Alloy; Contact Plating: Gold; Min Operating Temperature: -40°C; Max Operating Temperature: 85°C; Packaging: Tape and Reel; Throw Configuration: SPDT; Voltage Rating (DC): 6V; Current Rating: 100mA; Termination: J-Hook; Orientation: Vertical; Length: 0.212inch; Radiation Hardening: No; Lead Free: Lead Free; ComponentLink1URL: https://datasheet.ciiva.com/2864/cjs-2864476.pdf?src-supplier=Digi-Key; ComponentLink1Description: https://datasheet.ciiva.com/2864/cjs-2864476.pdf?src-supplier=Digi-Key; ComponentLink2URL: https://datasheet.ciiva.com/2864/cjs-2864477.pdf?src-supplier=Digi-Key; ComponentLink2Description: https://datasheet.ciiva.com/2864/cjs-2864477.pdf?src-supplier=Digi-Key; ComponentLink3URL: https://datasheet.ciiva.com/2864/cjs-2864478.pdf?src-supplier=Digi-Key; ComponentLink3Description: https://datasheet.ciiva.com/2864/cjs-2864478.pdf?src-supplier=Digi-Key

## Sheet Connectors.SchDoc
size A
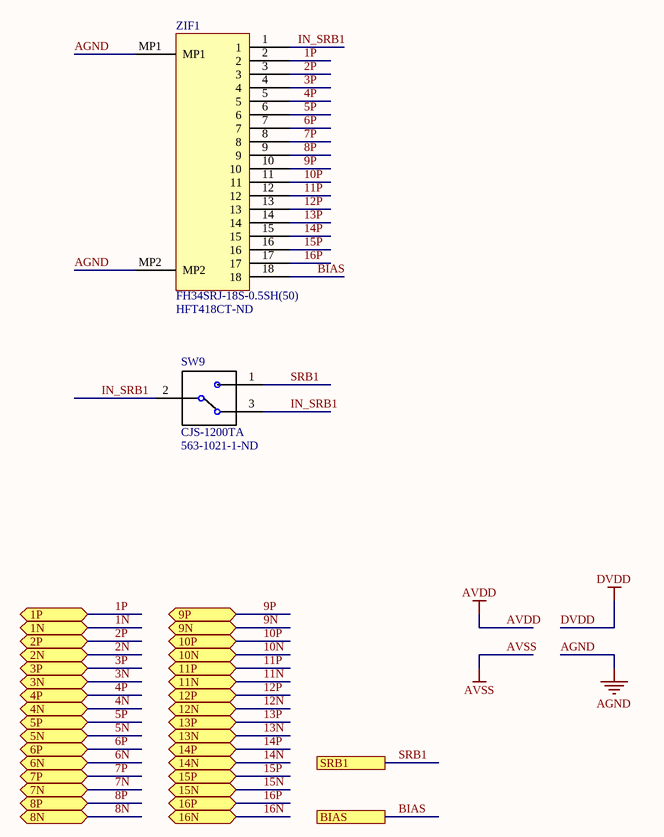
[diagram p8: Connectors.SchDoc]

### Parts
SW9  CJS-1200TA  Supplier Part Number 1: 563-1021-1-ND  [*SW_CJS-1200TA]
ZIF1  FH34SRJ-18S-0.5SH(50)  Supplier Part Number 1: HFT418CT-ND  [ZIF_18S]

### Ports
1N (bidir), 1P (bidir), 2N (bidir), 2P (bidir), 3N (bidir), 3P (bidir), 4N (bidir), 4P (bidir), 5N (bidir), 5P (bidir), 6N (bidir), 6P (bidir), 7N (bidir), 7P (bidir), 8N (bidir), 8P (bidir), 9N (bidir), 9P (bidir), 10N (bidir), 10P (bidir), 11N (bidir), 11P (bidir), 12N (bidir), 12P (bidir), 13N (bidir), 13P (bidir), 14N (bidir), 14P (bidir), 15N (bidir), 15P (bidir), 16N (bidir), 16P (bidir), BIAS, SRB1

### Nets
AGND: ZIF1.MP1 ZIF1.MP2
1N: port 1N
1P: ZIF1.2 ; port 1P
2N: port 2N
2P: ZIF1.3 ; port 2P
3N: port 3N
3P: ZIF1.4 ; port 3P
4N: port 4N
4P: ZIF1.5 ; port 4P
5N: port 5N
5P: ZIF1.6 ; port 5P
6N: port 6N
6P: ZIF1.7 ; port 6P
7N: port 7N
7P: ZIF1.8 ; port 7P
8N: port 8N
8P: ZIF1.9 ; port 8P
9N: port 9N
9P: ZIF1.10 ; port 9P
10N: port 10N
10P: ZIF1.11 ; port 10P
11N: port 11N
11P: ZIF1.12 ; port 11P
12N: port 12N
12P: ZIF1.13 ; port 12P
13N: port 13N
13P: ZIF1.14 ; port 13P
14N: port 14N
14P: ZIF1.15 ; port 14P
15N: port 15N
15P: ZIF1.16 ; port 15P
16N: port 16N
16P: ZIF1.17 ; port 16P
BIAS: ZIF1.18 ; port BIAS
IN_SRB1: SW9.2 SW9.3 ZIF1.1
SRB1: SW9.1 ; port SRB1

### Library data of the parts
SW9 = CJS-1200TA: as SW11 on sheet ADS_1; Supplier 1: Digi-Key; Manufacturer Part Number 1: CJS-1200TA; Stock 1: 72766; Pricing 1: 1=0.88000, 10=0.86000, 25=0.81000, 50=0.76040, 100=0.72730, 250=0.69428, 500=0.62814 (USD); RoHS: Yes; Mount: Surface Mount; Contact Material: Copper Alloy; Contact Plating: Gold; Min Operating Temperature: -40°C; Max Operating Temperature: 85°C; Packaging: Tape and Reel; Throw Configuration: SPDT; Voltage Rating (DC): 6V; Current Rating: 100mA; Termination: J-Hook; Orientation: Vertical; Length: 0.212inch; Radiation Hardening: No; Lead Free: Lead Free; ComponentLink1URL: https://datasheet.ciiva.com/2864/cjs-2864476.pdf?src-supplier=Digi-Key; ComponentLink1Description: https://datasheet.ciiva.com/2864/cjs-2864476.pdf?src-supplier=Digi-Key; ComponentLink2URL: https://datasheet.ciiva.com/2864/cjs-2864477.pdf?src-supplier=Digi-Key; ComponentLink2Description: https://datasheet.ciiva.com/2864/cjs-2864477.pdf?src-supplier=Digi-Key; ComponentLink3URL: https://datasheet.ciiva.com/2864/cjs-2864478.pdf?src-supplier=Digi-Key; ComponentLink3Description: https://datasheet.ciiva.com/2864/cjs-2864478.pdf?src-supplier=Digi-Key
ZIF1 = FH34SRJ-18S-0.5SH(50): CONN FFC FPC 18POS 0.50MM R/A; Manufacturer 1: Hirose; Actuator Material: Nylon,Polyamide; Current Rating: 500mA; Voltage Rating: 50V; Number of Positions: 18; Wire/Cable Type: Flat Flex; Insulation Resistance: 500MR; Gender: Receptacle; Pitch: 0.02inch; Supplier 1: Digi-Key; Manufacturer Part Number 1: FH34SRJ-18S-0.5SH(50); Stock 1: 1441; Pricing 1: 1=2.17000, 10=1.96700, 25=1.84680, 50=1.76660, 100=1.68630, 250=1.52572, 500=1.40526 (USD); RoHS: Yes; Mount: Surface Mount; Contact Plating: Gold; Contact Material: Bronze; Housing Material: Polymer; Min Operating Temperature: -55°C; Max Operating Temperature: 85°C; Package Quantity: 5000; Packaging: Tape and Reel; Termination: SMD/SMT; Number of Rows: 1; Number of Contacts: 18; Flammability Rating: UL94 V-0; REACH SVHC: No SVHC; ComponentLink1URL: https://datasheet.ciiva.com/46408/1693466-46408165.pdf?src-supplier=Element14; ComponentLink1Description: https://datasheet.ciiva.com/46408/1693466-46408165.pdf?src-supplier=Element14

## Nets that join several sheets
+3V3: power_supply (D8.2 SW2.1), wifi (5 pins)
acl3V3: power_supply (D8.1 SW2.2), sd_accel (5 pins)
AGND: PIC (12 pins), power_supply (25 pins), ADS_2 (10 pins), wifi (7 pins), sd_accel (12 pins), interface2 (D15.3 D16.3 D17.3 D18.3), ADS_1 (9 pins), interface1 (9 pins), Connectors (ZIF1.MP1 ZIF1.MP2)
AVDD: power_supply (9 pins), ADS_2 (6 pins), ADS_1 (6 pins), interface1 (D7.2)
AVSS: power_supply (5 pins), ADS_2 (16 pins), ADS_1 (16 pins), interface1 (D2.4)
DVDD: PIC (7 pins), power_supply (14 pins), ADS_2 (U9.35 U9.48 U9.50), sd_accel (C4.1 CONN1.4), ADS_1 (U6.35 U6.48 U6.50 U6.52)
1P: interface1 (D2.1 R1.2), Connectors (ZIF1.2)
2P: interface1 (D3.5 R2.4), Connectors (ZIF1.3)
3P: interface1 (D3.1 R2.2), Connectors (ZIF1.4)
4P: interface1 (D4.5 R3.4), Connectors (ZIF1.5)
5P: interface1 (D4.1 R3.2), Connectors (ZIF1.6)
6P: interface1 (D5.5 R4.4), Connectors (ZIF1.7)
7P: interface1 (D5.1 R4.2), Connectors (ZIF1.8)
8P: interface1 (D6.5 R6.4), Connectors (ZIF1.9)
9P: interface2 (D15.1 R20.1), Connectors (ZIF1.10)
10P: interface2 (D15.4 R20.3), Connectors (ZIF1.11)
11P: interface2 (D16.1 R21.1), Connectors (ZIF1.12)
12P: interface2 (D16.4 R21.3), Connectors (ZIF1.13)
13P: interface2 (D17.1 R22.1), Connectors (ZIF1.14)
14P: interface2 (D17.4 R22.3), Connectors (ZIF1.15)
15P: interface2 (D18.1 R23.1), Connectors (ZIF1.16)
16P: interface2 (D18.4 R23.3), Connectors (ZIF1.17)
_SRB1: ADS_2 (U9.17), ADS_1 (SW11.2 U6.17), interface1 (C3.5 R1.5 SW8.1)
_SRB2: ADS_2 (U9.18), ADS_1 (SW11.1 U6.18), interface1 (C3.6 R1.6)
BIAS: interface1 (D7.4 R6.1), Connectors (ZIF1.18)
BIAS_DRV: ADS_2 (SW10.1), ADS_1 (C16.1 R5.1 U6.62 U6.63), interface1 (C34.8 R6.8)
BIAS_INV: ADS_2 (C53.2 R25.2 U9.61), ADS_1 (C16.2 R5.2 U6.61)
CLK: ADS_2 (U9.37), ADS_1 (U6.37)
CS1: PIC (U7.23), ADS_1 (U6.39)
CS2: PIC (U7.15), ADS_2 (U9.39)
CS3: PIC (U7.14), sd_accel (CONN1.2)
CS4: PIC (U7.13), sd_accel (U1.8 U2.1)
D13: PIC (U7.3), wifi (R17.2 WIFI1.16)
D18: PIC (U7.9), wifi (R12.1 SW4.1 SW4.2 WIFI1.1)
DRDY: PIC (U7.27), ADS_1 (U6.47)
GPIO1: ADS_2 (U9.42), ADS_1 (U6.42)
GPIO2: ADS_2 (U9.44), ADS_1 (U6.44)
GPIO3: ADS_2 (U9.45), ADS_1 (U6.45)
GPIO4: ADS_2 (U9.46), ADS_1 (U6.46)
IN1P: ADS_1 (U6.16), interface1 (C3.7 R1.7)
IN2P: ADS_1 (U6.14), interface1 (C9.5 R2.5)
IN3P: ADS_1 (U6.12), interface1 (C9.7 R2.7)
IN4P: ADS_1 (U6.10), interface1 (C11.5 R3.5)
IN5P: ADS_1 (U6.8), interface1 (C11.7 R3.7)
IN6P: ADS_1 (U6.6), interface1 (C26.5 R4.5)
IN7P: ADS_1 (U6.4), interface1 (C26.7 R4.7)
IN8P: ADS_1 (U6.2), interface1 (C34.5 R6.5)
IN9P: ADS_2 (U9.16), interface2 (C63.8 R20.8)
IN10P: ADS_2 (U9.14), interface2 (C63.6 R20.6)
IN11P: ADS_2 (U9.12), interface2 (C64.8 R21.8)
IN12P: ADS_2 (U9.10), interface2 (C64.6 R21.6)
IN13P: ADS_2 (U9.8), interface2 (C65.8 R22.8)
IN14P: ADS_2 (U9.6), interface2 (C65.6 R22.6)
IN15P: ADS_2 (U9.4), interface2 (C66.8 R23.8)
IN16P: ADS_2 (U9.2), interface2 (C66.6 R23.6)
INT1: PIC (U7.11), sd_accel (U1.11)
MISO: PIC (U7.19), ADS_2 (U9.43), wifi (WIFI1.6), sd_accel (CONN1.7 U1.7), ADS_1 (U6.43)
MOSI: PIC (U7.28), ADS_2 (U9.34), wifi (WIFI1.7), sd_accel (CONN1.3 U2.2), ADS_1 (U6.34)
RESET: PIC (U7.18), ADS_2 (U9.36), ADS_1 (U6.36)
SCLK: PIC (U7.22), ADS_2 (U9.40), wifi (WIFI1.5), sd_accel (CONN1.5 U1.4), ADS_1 (U6.40)
SET1: interface2 (16 pins), interface1 (21 pins)
SRB1: interface1 (D2.5 R1.4), Connectors (SW9.1)